# Altium schematic sheet Socket_Burners.schdoc
size 307 x 218 mm; Symbol: Drawing-Symbol_A4; Device: Drawing-Symbol_A4; @Project Name: Socket Burners; @Page Count: 1; @Update Date: 2025-12-10; @Create Date: 2025-10-13; @Schematic Name: Schematic1; @Page No: 1; @Page Name: Socket_Burners; Company: EasyEDA.com; Version: V1.0; Page Size: A4; Drawn: Imbulpitiya B.N.; @Create Time: 08:07:11; @Update Time: 11:36:46; Width: 1170; Height: 825; Region Start: 1; X Region Count: 6; Y Region Count: 4; Blade Width: 10; Title Block Position: 3; @Board Name: Board1
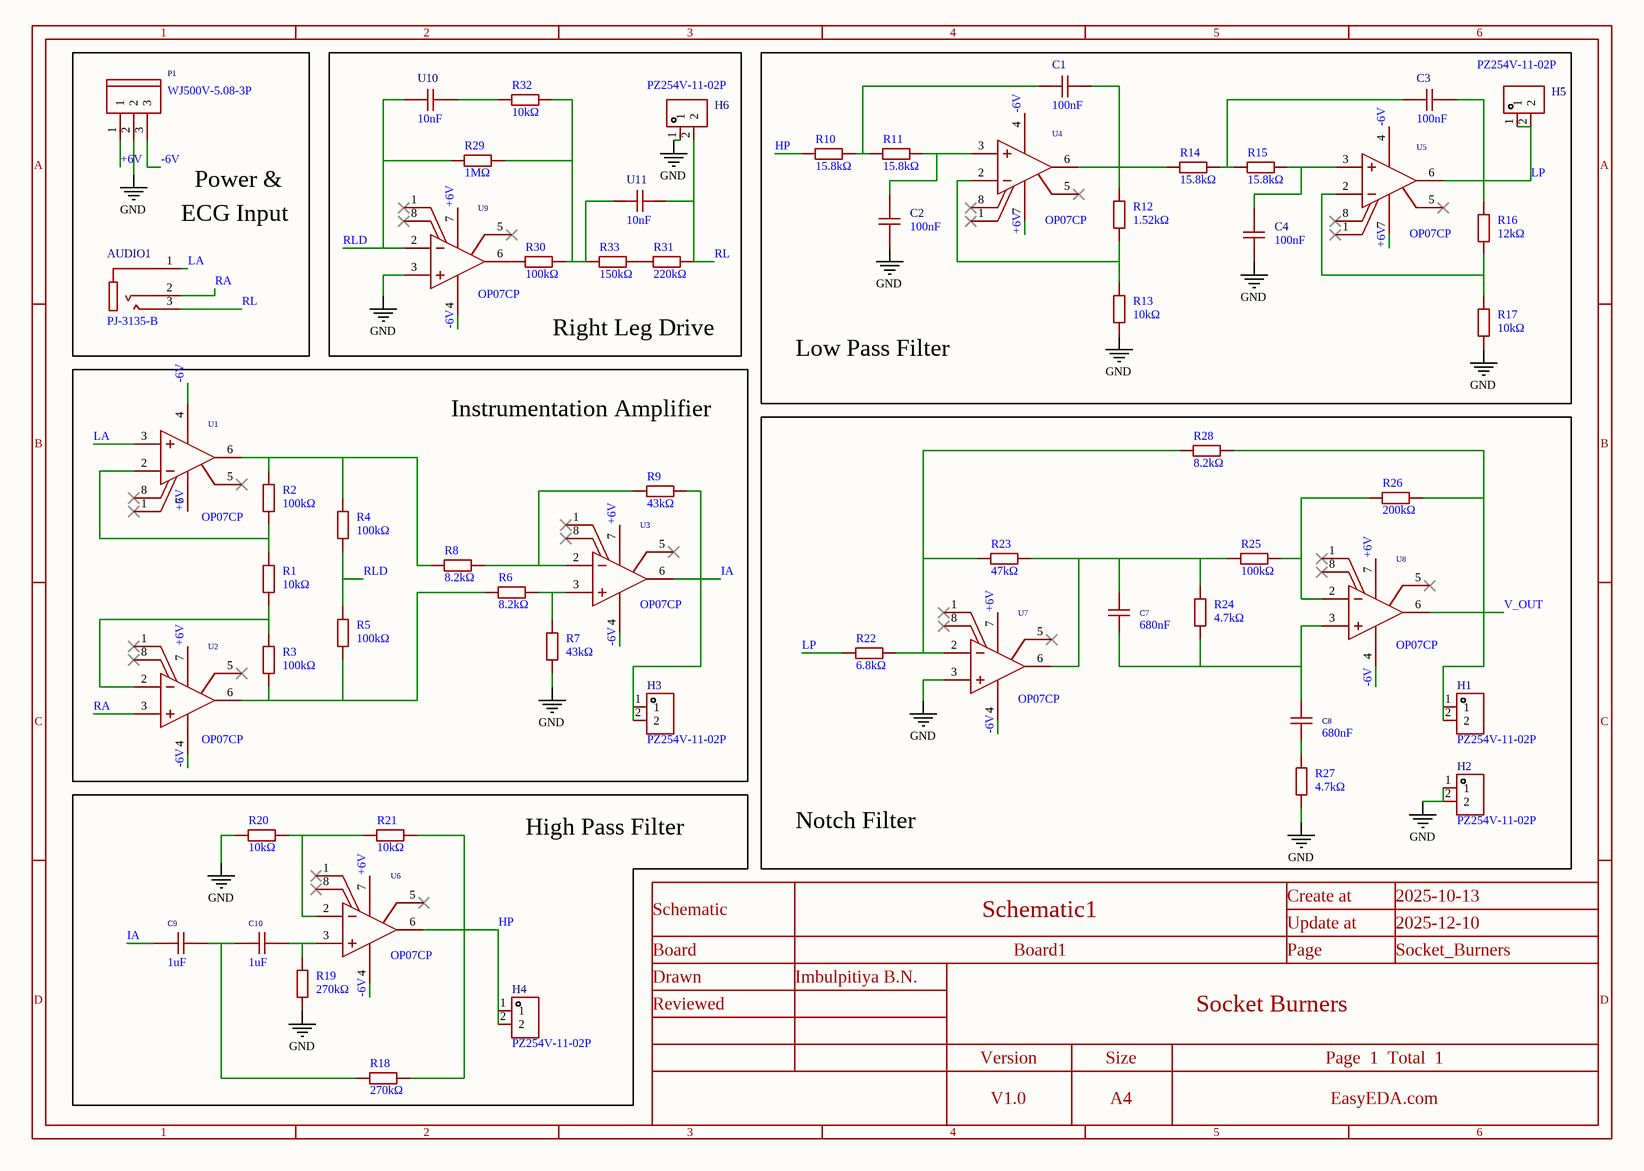
[diagram p0: Socket_Burners.schdoc]

## Parts
AUDIO1  PJ-3135-B  [AUDIO-TH_PJ-3135-B]
C1  100nF  [CAP-TH_L5.3-W3.2-P2.54-D0.6-S2.65]
C2  100nF  [CAP-TH_L5.3-W3.2-P2.54-D0.6-S2.65]
C3  100nF  [CAP-TH_L5.3-W3.2-P2.54-D0.6-S2.65]
C4  100nF  [CAP-TH_L5.3-W3.2-P2.54-D0.6-S2.65]
C7  680nF  [CAP-TH_L23.0-W8.0-P20.00-D1.2]
C8  680nF  [CAP-TH_L23.0-W8.0-P20.00-D1.2]
C9  1uF  [CAP-TH_L17.0-W8.0-P15.00-D1.2]
C10  1uF  [CAP-TH_L17.0-W8.0-P15.00-D1.2]
H1  PZ254V-11-02P  [HDR-TH_2P-P2.54-V-M]
H2  PZ254V-11-02P  [HDR-TH_2P-P2.54-V-M]
H3  PZ254V-11-02P  [HDR-TH_2P-P2.54-V-M]
H4  PZ254V-11-02P  [HDR-TH_2P-P2.54-V-M]
H5  PZ254V-11-02P  [HDR-TH_2P-P2.54-V-M]
H6  PZ254V-11-02P  [HDR-TH_2P-P2.54-V-M]
P1  WJ500V-5.08-3P  [CONN-TH_3P-P5.00_WJ500V-5.08-3P]
R1  10kΩ  [RES-TH_BD1.8-L3.2-P7.20-D0.4]
R2  100kΩ  [RES-TH_BD1.8-L3.2-P7.20-D0.4]
R3  100kΩ  [RES-TH_BD1.8-L3.2-P7.20-D0.4]
R4  100kΩ  [RES-TH_BD1.8-L3.2-P7.20-D0.4]
R5  100kΩ  [RES-TH_BD1.8-L3.2-P7.20-D0.4]
R6  8.2kΩ  [RES-TH_BD1.8-L3.2-P7.20-D0.4]
R7  43kΩ  [RES-TH_BD1.8-L3.2-P7.20-D0.4]
R8  8.2kΩ  [RES-TH_BD1.8-L3.2-P7.20-D0.4]
R9  43kΩ  [RES-TH_BD1.8-L3.2-P7.20-D0.4]
R10  15.8kΩ  [RES-TH_BD1.8-L3.2-P7.20-D0.4]
R11  15.8kΩ  [RES-TH_BD1.8-L3.2-P7.20-D0.4]
R12  1.52kΩ  [RES-TH_BD1.8-L3.2-P7.20-D0.4]
R13  10kΩ  [RES-TH_BD1.8-L3.2-P7.20-D0.4]
R14  15.8kΩ  [RES-TH_BD1.8-L3.2-P7.20-D0.4]
R15  15.8kΩ  [RES-TH_BD1.8-L3.2-P7.20-D0.4]
R16  12kΩ  [RES-TH_BD1.8-L3.2-P7.20-D0.4]
R17  10kΩ  [RES-TH_BD1.8-L3.2-P7.20-D0.4]
R18  270kΩ  [RES-TH_BD1.8-L3.2-P7.20-D0.4]
R19  270kΩ  [RES-TH_BD1.8-L3.2-P7.20-D0.4]
R20  10kΩ  [RES-TH_BD1.8-L3.2-P7.20-D0.4]
R21  10kΩ  [RES-TH_BD1.8-L3.2-P7.20-D0.4]
R22  6.8kΩ  [RES-TH_BD1.8-L3.2-P7.20-D0.4]
R23  47kΩ  [RES-TH_BD1.8-L3.2-P7.20-D0.4]
R24  4.7kΩ  [RES-TH_BD1.8-L3.2-P7.20-D0.4]
R25  100kΩ  [RES-TH_BD1.8-L3.2-P7.20-D0.4]
R26  200kΩ  [RES-TH_BD1.8-L3.2-P7.20-D0.4]
R27  4.7kΩ  [RES-TH_BD1.8-L3.2-P7.20-D0.4]
R28  8.2kΩ  [RES-TH_BD1.8-L3.2-P7.20-D0.4]
R29  1MΩ  [RES-TH_BD1.8-L3.2-P7.20-D0.4]
R30  100kΩ  [RES-TH_BD1.8-L3.2-P7.20-D0.4]
R31  220kΩ  [RES-TH_BD1.8-L3.2-P7.20-D0.4]
R32  10kΩ  [RES-TH_BD1.8-L3.2-P7.20-D0.4]
R33  150kΩ  [RES-TH_BD1.8-L3.2-P7.20-D0.4]
U1  OP07CP  [DIP-8_L9.6-W6.4-P2.54-LS7.6-BL-1]
U2  OP07CP  [DIP-8_L9.6-W6.4-P2.54-LS7.6-BL-1]
U3  OP07CP  [DIP-8_L9.6-W6.4-P2.54-LS7.6-BL-1]
U4  OP07CP  [DIP-8_L9.6-W6.4-P2.54-LS7.6-BL-1]
U5  OP07CP  [DIP-8_L9.6-W6.4-P2.54-LS7.6-BL-1]
U6  OP07CP  [DIP-8_L9.6-W6.4-P2.54-LS7.6-BL-1]
U7  OP07CP  [DIP-8_L9.6-W6.4-P2.54-LS7.6-BL-1]
U8  OP07CP  [DIP-8_L9.6-W6.4-P2.54-LS7.6-BL-1]
U9  OP07CP  [DIP-8_L9.6-W6.4-P2.54-LS7.6-BL-1]
U10  10nF  [CAP-TH_L4.8-W2.8-P2.54-D0.7]
U11  10nF  [CAP-TH_L4.8-W2.8-P2.54-D0.7]

## Blocks framed on the sheet
Right Leg Drive: H6 R29-R33 U9-U11
Low Pass Filter: C1-C4 H5 R10-R17 U4 U5
Instrumentation Amplifier: H3 R1-R9 U1-U3
Notch Filter: C7 C8 H1 H2 R22-R28 U7 U8
High Pass Filter: C9 C10 H4 R18-R21 U6

## Nets
GND: C2.2 C4.2 H2.1 H2.2 H6.1 P1.2 R7.1 R13.1 R17.1 R19.1 R20.2 R27.2 U7.3(IN+) U9.3(IN+)
+6V: P1.1 U1.7(VCC+) U2.7(VCC+) U3.7(VCC+) U4.7(VCC+) U5.7(VCC+) U6.7(VCC+) U7.7(VCC+) U8.7(VCC+) U9.7(VCC+)
-6V: P1.3 U1.4(VCC-) U2.4(VCC-) U3.4(VCC-) U4.4(VCC-) U5.4(VCC-) U6.4(VCC-) U7.4(VCC-) U8.4(VCC-) U9.4(VCC-)
HP: H4.1 H4.2 R10.1 R18.1 R21.1 U6.6(OUT)
IA: C9.2 H3.1 H3.2 R9.2 U3.6(OUT)
LA: AUDIO1.1 U1.3(IN+)
LP: C3.2 H5.1 H5.2 R16.2 R22.1 U5.6(OUT)
RA: AUDIO1.2 U2.3(IN+)
RL: AUDIO1.3 H6.2 R31.2 U11.2
RLD: R4.1 R5.2 R29.1 U9.2(IN-) U10.1
V_OUT: H1.1 H1.2 R26.1 R28.2 U8.6(OUT)
NetC1_1: C1.1 R10.2 R11.1
NetC1_2: C1.2 R12.2 R14.1 U4.6(OUT)
NetC2_1: C2.1 R11.2 U4.3(IN+)
NetC3_1: C3.1 R14.2 R15.1
NetC4_1: C4.1 R15.2 U5.3(IN+)
NetC7_1: C7.1 C8.2 R24.1 U8.3(IN+)
NetC7_2: C7.2 R23.2 R24.2 R25.2 U7.6(OUT)
NetC8_1: C8.1 R27.1
NetC9_1: C9.1 C10.2 R18.2
NetC10_1: C10.1 R19.2 U6.3(IN+)
NetR1_1: R1.1 R3.2 U2.2(IN-)
NetR1_2: R1.2 R2.1 U1.2(IN-)
NetR2_2: R2.2 R4.2 R8.1 U1.6(OUT)
NetR3_1: R3.1 R5.1 R6.1 U2.6(OUT)
NetR6_2: R6.2 R7.2 U3.3(IN+)
NetR8_2: R8.2 R9.1 U3.2(IN-)
NetR12_1: R12.1 R13.2 U4.2(IN-)
NetR16_1: R16.1 R17.2 U5.2(IN-)
NetR20_1: R20.1 R21.2 U6.2(IN-)
NetR22_2: R22.2 R23.1 R28.1 U7.2(IN-)
NetR25_1: R25.1 R26.2 U8.2(IN-)
NetR29_2: R29.2 R30.2 R32.2 R33.1 U11.1
NetR30_1: R30.1 U9.6(OUT)
NetR31_1: R31.1 R33.2
NetR32_1: R32.1 U10.2

Not connected (* = marked no-connect by the designer): U1 1(OFFSET_N1)* 5(NC)* 8(OFFSET_N2)*; U2 1(OFFSET_N1)* 5(NC)* 8(OFFSET_N2)*; U3 1(OFFSET_N1)* 5(NC)* 8(OFFSET_N2)*; U4 1(OFFSET_N1)* 5(NC)* 8(OFFSET_N2)*; U5 1(OFFSET_N1)* 5(NC)* 8(OFFSET_N2)*; U6 1(OFFSET_N1)* 5(NC)* 8(OFFSET_N2)*; U7 1(OFFSET_N1)* 5(NC)* 8(OFFSET_N2)*; U8 1(OFFSET_N1)* 5(NC)* 8(OFFSET_N2)*; U9 1(OFFSET_N1)* 5(NC)* 8(OFFSET_N2)*

## Notes on the sheet
- (near AUDIO1) ECG Input
- Power &
- 1
- 2
- 3
- 4
- 5
- 6
- A
- B
- C
- Schematic
- Schematic1
- Create at
- Update at
- 2025-10-13
- 2025-12-10
- Board
- Drawn
- Imbulpitiya B.N.
- Board1
- Page
- Socket_Burners
- D
- Reviewed
- Version
- Size
- Socket Burners
- Page  1  Total  1
- V1.0
- A4
- EasyEDA.com

## Library data of the parts
AUDIO1 = PJ-3135-B: Manufacturer: XKB Connection(中国星坤); Symbol: PJ-313D_C319112; Add into BOM: yes; Connector Type: 3.5mm Headphone Jack; Current Rating: 10A; Voltage Rating (Max): 30V; Device: PJ-3135-B; LCSC Part Name: 黑色 3.5mm耳机座; Supplier Part: C319112; Manufacturer Part: PJ-3135-B; Supplier Footprint: 插件; JLCPCB Part Class: Extended Part; Datasheet: https://item.szlcsc.com/datasheet/PJ-3135-B/300204.html; Supplier: LCSC; Convert to PCB: yes; Operating Temperature: -20℃~+70℃
C1-C4 = CC1H104ZA1ED3F5O1100: Manufacturer: Dersonic(德尔创); Add into BOM: yes; Tolerance: -20%~+80%; Voltage Rating: 50V; Pin Spacing: 2.54mm; Temperature Coefficient: Y5V; Body Thickness: 3.2mm; Symbol: CC1H104ZA1ED3F5O1100; Device: CC1H104ZA1ED3F5O1100; LCSC Part Name: 100nF -20%~+80% 50V; Supplier Part: C2761728; Manufacturer Part: CC1H104ZA1ED3F5O1100; Supplier Footprint: 插件,P=2.54mm; JLCPCB Part Class: Extended Part; Datasheet: https://item.szlcsc.com/datasheet/CC1H104ZA1ED3F5O1100/2886475.html; Supplier: LCSC; Convert to PCB: yes; Value: 100nF; Diameter: 5.3mm
C7 C8 = MPP684K2E2408158LC: Manufacturer: SRD(圣融达); Symbol: MPP684K2240815LC; Add into BOM: yes; Tolerance: ±10%; Device: MPP684K2E2408158LC; Supplier: LCSC; Manufacturer Part: MPP684K2E2408158LC; Value: 680nF; Supplier Part: C109858; JLCPCB Part Class: Extended Part; LCSC Part Name: 680nF ±10%; Supplier Footprint: 插件,P=20mm; Datasheet: https://item.szlcsc.com/datasheet/MPP684K2E2408158LC/111079.html; Convert to PCB: yes; Voltage Rating: -; Operating Temperature: -40℃~+85℃
C9 C10 = KP105J2G1501: Manufacturer: KYET(科雅); Add into BOM: yes; Tolerance: ±5%; Voltage Rating: 400V; Symbol: KP105J2G1501; Device: KP105J2G1501; Supplier: LCSC; Supplier Part: C390150; Manufacturer Part: KP105J2G1501; Value: 1uF; JLCPCB Part Class: Extended Part; LCSC Part Name: 1uF ±5% 400V; Supplier Footprint: 插件,P=15mm; Datasheet: https://item.szlcsc.com/datasheet/KP105J2G1501/366183.html; Convert to PCB: yes; Operating Temperature: -40℃~+100℃
H1-H6 = PZ254V-11-02P: Manufacturer: XFCN(兴飞); Add into BOM: yes; Pin Structure: 1x2P; Pitch: 2.54mm; Circluar Pins/Square Pins: Pin Header; Symbol: PZ254V-11-02P; Device: PZ254V-11-02P; LCSC Part Name: 1x2P 间距:2.54mm 方针 直插; Supplier Part: C492401; Manufacturer Part: PZ254V-11-02P; Supplier Footprint: 插件,P=2.54mm; JLCPCB Part Class: Extended Part; Datasheet: https://item.szlcsc.com/datasheet/PZ254V-11-02P/502957.html; Supplier: LCSC; Convert to PCB: yes; Row Spacing: -; Mounting Type: Through Hole; Number of Rows: 1; Number of Pins: 2P; Current Rating: -; Voltage Rating (Max): -; Length of Mating Pin: 6mm; Insulation Height: 2.5mm; Length of End Connection Pin: 3mm; Contact Material: Brass; Contact Plating: -; Operating Temperature: -40℃~+105℃; Color: Black
P1 = WJ500V-5.08-3P: Manufacturer: KANGNEX(康奈克斯电气); Symbol: WJ500V-5.08-3P-14-00A; Add into BOM: yes; Number of Positions or Pins: 1x3P; Pitch: 5.08mm; Number of PINs Per Row: 3; Current Rating: 18A; Voltage Rating (Max): 250V; Wire Gauge - AWG: 14~30; Wire Gauge - mm2: 2.5; Device: WJ500V-5.08-3P; Supplier: LCSC; Manufacturer Part: WJ500V-5.08-3P; Supplier Part: C72334; JLCPCB Part Class: Extended Part; LCSC Part Name: 5.08mm 1x3P 排数:1 每排P数:3 直插; Supplier Footprint: 插件,P=5.08mm; Datasheet: https://item.szlcsc.com/datasheet/WJ500V-5.08-3P/73443.html; Convert to PCB: yes; Color: Green; Mounting Type: Through Hole; Number of Pins: 3P; Number of Rows: 1; Operating Temperature: -40℃~+105℃
R1-R33 = Res_AXIAL-1/8W: Symbol: Res; Convert to PCB: yes; Device: Res_AXIAL-1/8W; Add into BOM: yes; Supplier Footprint: Through
  R1 R13 R17 R20 R21 R32: Value: 10kΩ
  R2-R5 R25 R30: Value: 100kΩ
  R6 R8 R28: Value: 8.2kΩ
  R7 R9: Value: 43kΩ
  R10 R11 R14 R15: Value: 15.8kΩ
  R12: Value: 1.52kΩ
  R16: Value: 12kΩ
  R18 R19: Value: 270kΩ
  R22: Value: 6.8kΩ
  R23: Value: 47kΩ
  R24 R27: Value: 4.7kΩ
  R26: Value: 200kΩ
  R29: Value: 1MΩ
  R31: Value: 220kΩ
  R33: Value: 150kΩ
U1-U9 = OP07CP: Manufacturer: TI(德州仪器); Add into BOM: yes; Number of Channels: 1; Gain Bandwidth Product: 600kHz; Ib - Input Bias Current: 1.8nA; Vos - Input Offset Voltage: 60uV; Common Mode Rejection Ratio(CMRR): 120dB; Slew Rate: 0.3V/us; Input Offset Voltage Drift(Vos TC): 500nV/℃; Dual Supply: -18V~18V; Maximum Power Supply Range (Vdd-Vss): 36V; Noise density(eN): 10.5nV/√Hz@10Hz; Input Offset Current(Ios): 1.6nA; Input Offset Current Drift (Ios TC): 12pA/℃; Symbol: OP07CP; Device: OP07CP; Supplier: LCSC; Manufacturer Part: OP07CP; Supplier Part: C5224; JLCPCB Part Class: Extended Part; LCSC Part Name: 精密运算放大器; Supplier Footprint: PDIP-8; Datasheet: https://www.ti.com.cn/cn/lit/ds/symlink/op07.pdf; Convert to PCB: yes; Rail to Rail: -; Operating Temperature: 0℃~+70℃
U10 U11 = CC1H102MA1EDB44B1100: Manufacturer: Dersonic(德尔创); Add into BOM: yes; Tolerance: ±20%; Voltage Rating: 50V; Pin Spacing: 2.54mm; Temperature Coefficient: Y5P; Body Thickness: 2.4mm; Symbol: CC1H102MA1EDB44B1100; Device: CC1H102MA1EDB44B1100; LCSC Part Name: 1nF ±20% 50V; Manufacturer Part: CC1H102MA1EDB44B1100; Supplier Footprint: 插件,P=2.54mm; JLCPCB Part Class: Extended Part; Datasheet: https://item.szlcsc.com/datasheet/CC1H102MA1EDB44B1100/2990642.html; Supplier: LCSC; Convert to PCB: yes; Value: 10nF; Diameter: 4.8mm